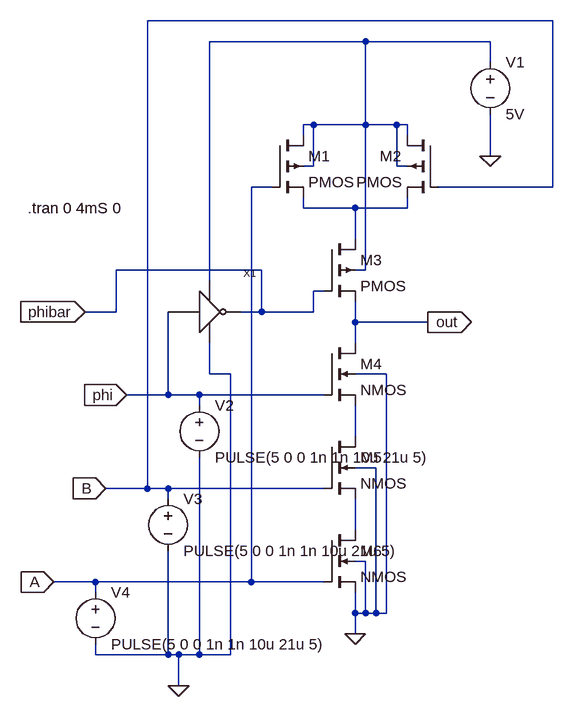
[diagram p0: schematic C2mos_NAND.asc]
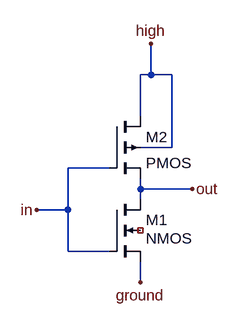
[diagram p1: sub-circuit not.asc]
C2mos_NAND.asc, the LTspice schematic file:
Version 4
SHEET 1 880 680
WIRE 496 -592 -128 -592
WIRE 208 -560 -32 -560
WIRE 400 -560 208 -560
WIRE 400 -528 400 -560
WIRE 128 -432 112 -432
WIRE 208 -432 208 -560
WIRE 208 -432 128 -432
WIRE 256 -432 208 -432
WIRE 272 -432 256 -432
WIRE 112 -416 112 -432
WIRE 272 -416 272 -432
WIRE 400 -384 400 -448
WIRE 128 -368 128 -432
WIRE 128 -368 112 -368
WIRE 256 -368 256 -432
WIRE 272 -368 256 -368
WIRE 64 -336 32 -336
WIRE 496 -336 496 -592
WIRE 496 -336 320 -336
WIRE 112 -304 112 -320
WIRE 192 -304 112 -304
WIRE 272 -304 272 -320
WIRE 272 -304 192 -304
WIRE 192 -256 192 -304
WIRE 48 -208 -176 -208
WIRE 208 -208 208 -432
WIRE 208 -208 192 -208
WIRE -32 -192 -32 -560
WIRE 144 -176 128 -176
WIRE -176 -144 -176 -208
WIRE -176 -144 -224 -144
WIRE 48 -144 48 -208
WIRE 48 -144 16 -144
WIRE 128 -144 128 -176
WIRE 128 -144 48 -144
WIRE 192 -128 192 -160
WIRE 304 -128 192 -128
WIRE 192 -96 192 -128
WIRE -32 -48 -32 -96
WIRE 0 -48 -32 -48
WIRE 240 -48 192 -48
WIRE -96 -16 -96 -144
WIRE -96 -16 -160 -16
WIRE -48 -16 -96 -16
WIRE 144 -16 -48 -16
WIRE -48 0 -48 -16
WIRE 192 48 192 0
WIRE 224 96 192 96
WIRE -128 128 -128 -592
WIRE -128 128 -192 128
WIRE -96 128 -128 128
WIRE 144 128 -96 128
WIRE -96 144 -96 128
WIRE 192 192 192 144
WIRE 208 240 192 240
WIRE -208 272 -272 272
WIRE 32 272 32 -336
WIRE 32 272 -208 272
WIRE 144 272 32 272
WIRE -208 288 -208 272
WIRE 192 320 192 288
WIRE 208 320 208 240
WIRE 208 320 192 320
WIRE 224 320 224 96
WIRE 224 320 208 320
WIRE 240 320 240 -48
WIRE 240 320 224 320
WIRE 192 352 192 320
WIRE -208 384 -208 368
WIRE -96 384 -96 224
WIRE -96 384 -208 384
WIRE -80 384 -96 384
WIRE -48 384 -48 80
WIRE -48 384 -80 384
WIRE 0 384 0 -48
WIRE 0 384 -48 384
WIRE -80 432 -80 384
FLAG 192 352 0
FLAG 400 -384 0
FLAG 304 -128 out
IOPIN 304 -128 Out
FLAG -80 432 0
FLAG -160 -16 phi
IOPIN -160 -16 In
FLAG -192 128 B
IOPIN -192 128 In
FLAG -272 272 A
IOPIN -272 272 In
FLAG -224 -144 phibar
IOPIN -224 -144 In
SYMBOL pmos4 64 -416 R0
SYMATTR InstName M1
SYMBOL pmos4 320 -416 M0
SYMATTR InstName M2
SYMBOL pmos4 144 -256 R0
SYMATTR InstName M3
SYMBOL nmos4 144 -96 R0
SYMATTR InstName M4
SYMBOL nmos4 144 48 R0
SYMATTR InstName M5
SYMBOL nmos4 144 192 R0
SYMATTR InstName M6
SYMBOL voltage 400 -544 R0
WINDOW 123 0 0 Left 0
WINDOW 39 0 0 Left 0
SYMATTR InstName V1
SYMATTR Value 5V
SYMBOL voltage -48 -16 R0
WINDOW 123 0 0 Left 0
WINDOW 39 0 0 Left 0
SYMATTR InstName V2
SYMATTR Value PULSE(5 0 0 1n 1n 10u 21u 5)
SYMBOL voltage -96 128 R0
WINDOW 123 0 0 Left 0
WINDOW 39 0 0 Left 0
SYMATTR InstName V3
SYMATTR Value PULSE(5 0 0 1n 1n 10u 21u 5)
SYMBOL voltage -208 272 R0
WINDOW 123 0 0 Left 0
WINDOW 39 0 0 Left 0
SYMATTR InstName V4
SYMATTR Value PULSE(5 0 0 1n 1n 10u 21u 5)
SYMBOL NOT 0 -144 R0
SYMATTR InstName X1
TEXT -312 -304 Left 2 !.tran 0 4mS 0

not.asc, the sub-circuit schematic file:
Version 4
SHEET 1 880 680
WIRE 176 -64 176 -112
WIRE 176 -64 160 -64
WIRE 208 -64 176 -64
WIRE 160 0 160 -64
WIRE 208 48 208 -64
WIRE 208 48 160 48
WIRE 112 80 48 80
WIRE 160 112 160 96
WIRE 240 112 160 112
WIRE 160 128 160 112
WIRE 48 144 48 80
WIRE 48 144 0 144
WIRE 48 208 48 144
WIRE 112 208 48 208
WIRE 160 256 160 224
FLAG 0 144 in
FLAG 240 112 out
FLAG 160 256 ground
FLAG 176 -112 high
SYMBOL nmos4 112 128 R0
WINDOW 3 56 60 Left 2
SYMATTR InstName M1
SYMBOL pmos4 112 0 R0
SYMATTR InstName M2

The netlist it stands for:
* C2mos_NAND.asc
M1 N001 A N002 N001 PMOS
M2 N001 B N002 N001 PMOS
M3 N002 phibar out N001 PMOS
M4 out phi N003 0 NMOS
M5 N003 B N004 0 NMOS
M6 N004 A 0 0 NMOS
V1 N001 0 5V
V2 phi 0 PULSE(5 0 0 1n 1n 10u 21u 5)
V3 B 0 PULSE(5 0 0 1n 1n 10u 21u 5)
V4 A 0 PULSE(5 0 0 1n 1n 10u 21u 5)
XX1 phi phibar N001 0 not

* block symbol definitions
.subckt not in out high ground
M1 out in ground NC_01 NMOS
M2 high in out high PMOS
.ends not

.model NMOS NMOS
.model PMOS PMOS
.lib standard.mos
.tran 0 4mS 0
.backanno
.end